# EAGLE design Linus.2 (EAGLE 9.2.2)
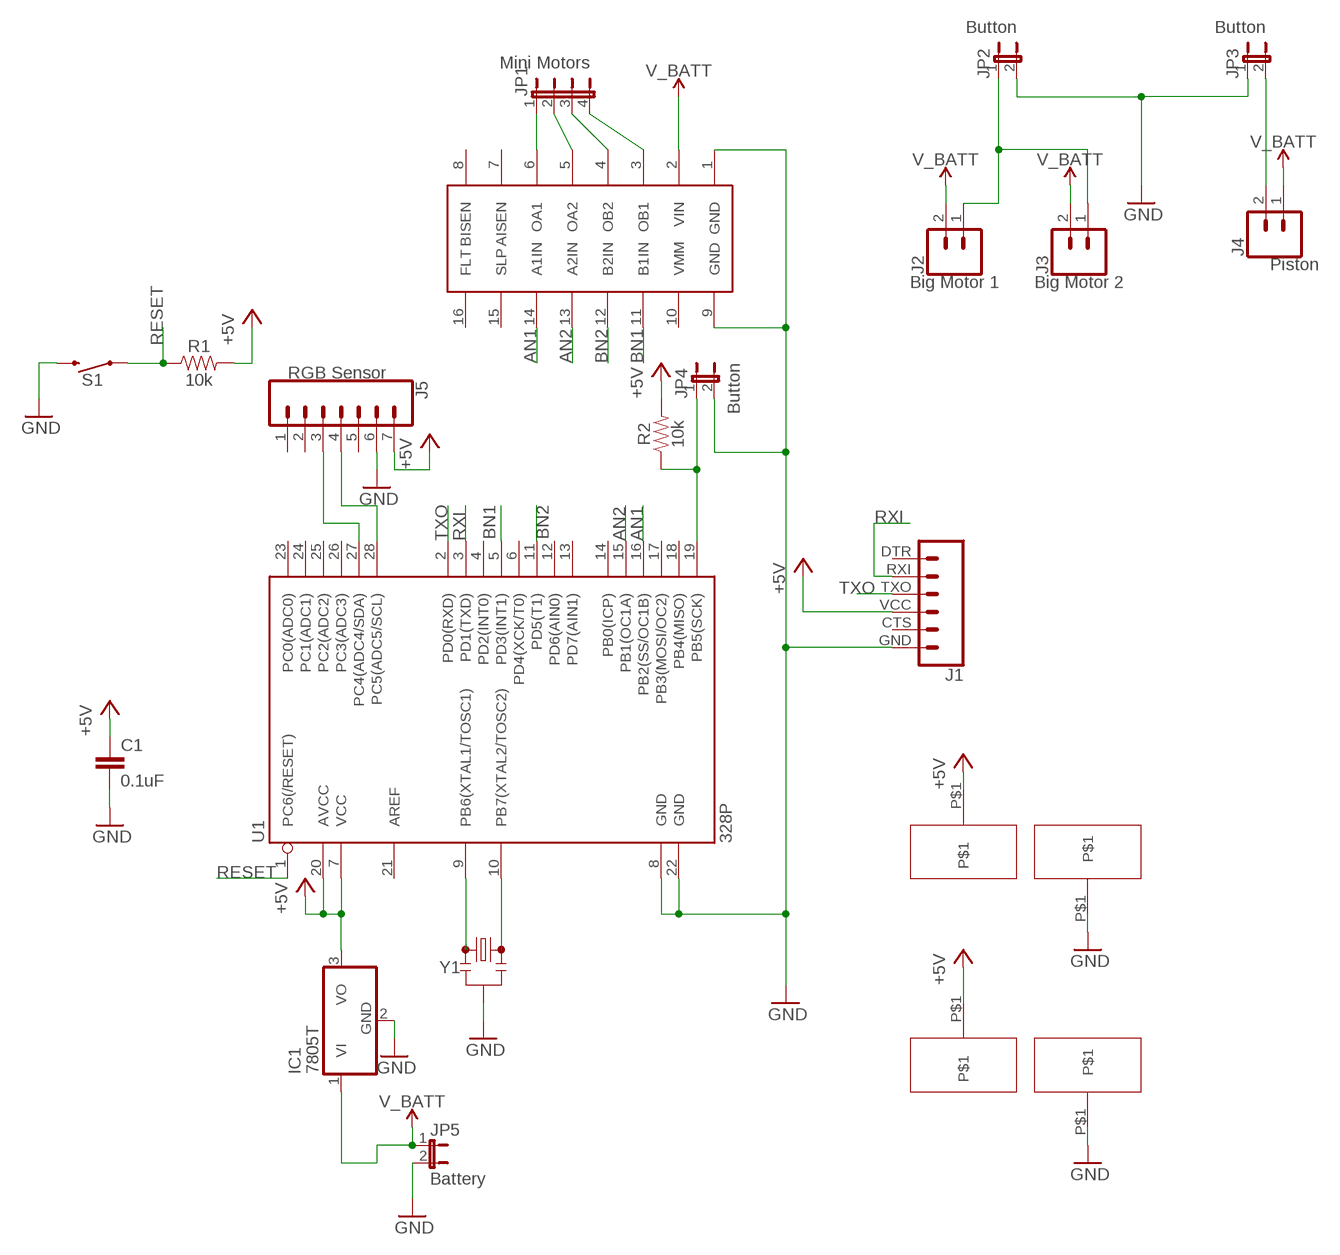
[diagram p0: schematic, sheet 1]

## Parts
C1  0.1uF  0.1UF-KIT-EZ-50V-20%  [CAP-PTH-SMALL-KIT]
IC1  7805T  [TO220H]
J1  6_PIN_SERIAL_CABLEPTH  [FTDI_BASIC]
J2  Big Motor 1  CONN_02  [1X02]
J3  Big Motor 2  CONN_02  [1X02]
J4  Piston  CONN_02  [1X02]
J5  RGB Sensor  CONN_07  [1X07]
JP1  Mini Motors  JP4E  [JP4]
JP2  Button  JP1E  [JP1]
JP3  Button  JP1E  [JP1]
JP4  Button  JP1E  [JP1]
JP5  Battery  JP1E  [JP1]
R1  10k  10KOHM-HORIZ-1/4W-1%  [AXIAL-0.3]
R2  10k  10KOHM-HORIZ-1/4W-1%  [AXIAL-0.3]
S1  MOMENTARY-SWITCH-SPST-PTH-6.0MM  [TACTILE_SWITCH_PTH_6.0MM]
U1  328P  ATMEGA328P_PDIP  [DIP28]
U$1  CONN_01  [CONN_01]  (not placed on a sheet)
U$2  MOTOR_DRIVER  [MOTOR_DRIVER]
U$3  CONN_01  [CONN_01]
U$4  CONN_01  [CONN_01]
U$5  CONN_01  [CONN_01]
U$6  CONN_01  [CONN_01]
Y1  RESONATORPTH-7.6X3.8  [RESONATOR-PTH-7.6X3.8]

## Nets
+5V: C1.1 IC1.3(VO) J1.VCC J5.7 R1.P$2 R2.P$2 U1.7(VCC) U1.20(AVCC) U$3.P$1 U$5.P$1
AN1: U1.16(PB2(SS/OC1B)) U$2.14(A1IN)
AN2: U1.15(PB1(OC1A)) U$2.13(A2IN)
BN1: U1.5(PD3(INT1)) U$2.11(B1IN)
BN2: U1.11(PD5(T1)) U$2.12(B2IN)
GND: C1.2 IC1.2(GND) J5.6 JP2.2 JP3.1 JP5.2 S1.3 U$4.P$1 U$6.P$1 Y1.2
N$1: J5.3 U1.27(PC4(ADC4/SDA))
N$2: J5.4 U1.28(PC5(ADC5/SCL))
N$3: U1.9(PB6(XTAL1/TOSC1)) Y1.1
N$4: U1.10(PB7(XTAL2/TOSC2)) Y1.3
N$5: JP1.1 U$2.6(OA1)
N$6: JP1.2 U$2.5(OA2)
N$7: JP1.3 U$2.4(OB2)
N$8: JP1.4 U$2.3(OB1)
N$10: J1.GND JP4.2 U1.8(GND) U1.22(GND) U$2.1(GND) U$2.9(GND) ; supply symbol labelled GND
N$12: J2.1 J3.1 JP2.1
N$13: J4.2 JP3.2
N$16: JP4.1 R2.P$1 U1.19(PB5(SCK))
RESET: R1.P$1 S1.1 U1.1(PC6(/RESET))
RXI: J1.RXI U1.3(PD1(TXD))
TXO: J1.TXO U1.2(PD0(RXD))
V_BATT: IC1.1(VI) J2.2 J3.2 J4.1 JP5.1 U$2.2(VIN)
Unconnected: J1.CTS J1.DTR J5.1 J5.2 J5.5 U1.4(PD2(INT0)) U1.6(PD4(XCK/T0)) U1.12(PD6(AIN0)) U1.13(PD7(AIN1)) U1.14(PB0(ICP)) U1.17(PB3(MOSI/OC2)) U1.18(PB4(MISO)) U1.21(AREF) U1.23(PC0(ADC0)) U1.24(PC1(ADC1)) U1.25(PC2(ADC2)) U1.26(PC3(ADC3)) U$1.P$1 U$2.7(AISEN) U$2.8(BISEN) U$2.10(VMM) U$2.15(SLP) U$2.16(FLT)

## Library data of the parts
C1 = Linus Eagle Library:0.1UF: 0.1µF ceramic capacitors A capacitor is a passive two-terminal electrical component used to store electrical energy temporarily in an electric field.; PROD_ID: CAP-08370
IC1 = adafruit:78*: Positive VOLTAGE REGULATOR Added bigger pads to the TO-92 package
J1 = Linus Eagle Library:6_PIN_SERIAL_CABLE: 6-pin header connection for use with the "FTDI BASIC" pinout - CABLE SIDE. Also known as "Arduino Serial Program Header". This is used on a design to provide a 6-pin connection point for serial communication usually from a USB cable (D+/D-) to these headers (RX/TX). It also has the remaining pins necessary for programming in the Arduino evironment (DTR, GND, and sometimes VCC). Note, this device has "CABLE" in the name. It is intended to be used on a design that usually lives on the end of your USB cable and prvides the converter chip (FTDI232 or FTDI231x) to commnicate serial RX/TX. The "sister" device, named "TARGET" is inteneded to be used on a design that contains a target micro-controller that you wish to program. You can populate with some of these: Female Headers <https://www.sparkfun.com/products/115> (PRT-00115) For reference (or to suit your programming needs) check out these designs: SparkFun FTDI Basic Breakout - 5V <https://www.sparkfun.com/products/9716> (DEV-09716) SparkFun FTDI Basic Breakout - 3.3V <https://www.sparkfun.com/products/9873> (DEV-09873) SparkFun FTDI SmartBasic <https://www.sparkfun.com/products/12935> (DEV-12935) SparkFun Beefy 3 - FTDI Basic Breakout <https://www.sparkfun.com/products/13746> (DEV-13746)
J2-J4 = Linus Eagle Library:CONN_02: Multi connection point. Often used as Generic Header-pin footprint for 0.1 inch spaced/style header connections On any of the 0.1 inch spaced packages, you can populate with these: Break Away Headers - Straight <https://www.sparkfun.com/products/116> (PRT-00116) Break Away Male Headers - Right Angle <https://www.sparkfun.com/products/553> (PRT-00553) Female Headers <https://www.sparkfun.com/products/115> (PRT-00115) Break Away Headers - Machine Pin <https://www.sparkfun.com/products/117> (PRT-00117) Break Away Female Headers - Swiss Machine Pin <https://www.sparkfun.com/products/743> (PRT-00743) For SCREWTERMINALS and SPRING TERMINALS visit here: Screw Terimnals on SparkFun.com <https://www.sparkfun.com/search/results?term=Screw+Terminals> (5mm/3.5mm/2.54mm spacing) This device is also useful as a general connection point to wire up your design to another part of your project. Our various solder wires solder well into these plated through hole pads. Hook-Up Wire - Assortment (Stranded, 22 AWG) <https://www.sparkfun.com/products/11375> (PRT-11375) Hook-Up Wire - Assortment (Solid Core, 22 AWG) <https://www.sparkfun.com/products/11367> (PRT-11367) View the entire wire category on our website here <https://www.sparkfun.com/categories/141> Special notes: Molex polarized connector foot print use with: PRT-08233 with associated crimp pins and housings. 2.54_SCREWTERM for use with PRT-10571. 3.5mm Screw Terminal footprints for PRT-08084 5mm Screw Terminal footprints for use with PRT-08432
J5 = Linus Eagle Library:CONN_07: Multi connection point. Often used as Generic Header-pin footprint for 0.1 inch spaced/style header connections On any of the 0.1 inch spaced packages, you can populate with these: Break Away Headers - Straight <https://www.sparkfun.com/products/116> (PRT-00116) Break Away Male Headers - Right Angle <https://www.sparkfun.com/products/553> (PRT-00553) Female Headers <https://www.sparkfun.com/products/115> (PRT-00115) Break Away Headers - Machine Pin <https://www.sparkfun.com/products/117> (PRT-00117) Break Away Female Headers - Swiss Machine Pin <https://www.sparkfun.com/products/743> (PRT-00743) For SCREWTERMINALS and SPRING TERMINALS visit here: Screw Terimnals on SparkFun.com <https://www.sparkfun.com/search/results?term=Screw+Terminals> (5mm/3.5mm/2.54mm spacing) This device is also useful as a general connection point to wire up your design to another part of your project. Our various solder wires solder well into these plated through hole pads. Hook-Up Wire - Assortment (Stranded, 22 AWG) <https://www.sparkfun.com/products/11375> (PRT-11375) Hook-Up Wire - Assortment (Solid Core, 22 AWG) <https://www.sparkfun.com/products/11367> (PRT-11367) View the entire wire category on our website here <https://www.sparkfun.com/categories/141> Special notes: Molex polarized connector foot print use with SKU : PRT-08231 with associated crimp pins and housings. 1MM SMD Version SKU: PRT-10208 NOTES ON THE VARIANTS LOCK and LOCK_LONGPADS... This footprint was designed to help hold the alignment of a through-hole component (i.e. 6-pin header) while soldering it into place. You may notice that each hole has been shifted either up or down by 0.005 of an inch from it's more standard position (which is a perfectly straight line). This slight alteration caused the pins (the squares in the middle) to touch the edges of the holes. Because they are alternating, it causes a "brace" to hold the component in place. 0.005 has proven to be the perfect amount of "off-center" position when using our standard breakaway headers. Although looks a little odd when you look at the bare footprint, once you have a header in there, the alteration is very hard to notice. Also,if you push a header all the way into place, it is covered up entirely on the bottom side.
JP1 = Linus Eagle Library:JP4E: JUMPER
JP2-JP4 = Linus Eagle Library:JP1E: JUMPER
JP5 = jumper:JP1E: JUMPER
R1 R2 = Linus Eagle Library:10KOHM: 10kΩ resistor A resistor is a passive two-terminal electrical component that implements electrical resistance as a circuit element. Resistors act to reduce current flow, and, at the same time, act to lower voltage levels within circuits. - Wikipedia; PROD_ID: RES-12183
S1 = Linus Eagle Library:MOMENTARY-SWITCH-SPST: Momentary Switch (Pushbutton) - SPST Normally-open (NO) SPST momentary switches (buttons, pushbuttons). Variants PTH-12MM - 12mm square, through-hole Momentary Pushbutton Switch - 12mm Square <https://www.sparkfun.com/products/9190> (COM-09190) PTH-6.0MM, PTH-6.0MM-KIT - 6.0mm square, through-hole Mini Pushbutton Switch <https://www.sparkfun.com/products/97> (COM-00097) KIT package intended for soldering kit's - only one side of pads' copper is exposed. PTH-RIGHT-ANGLE-KIT - Right-angle, through-hole Right Angle Tactile Button <https://www.sparkfun.com/products/10791> - Used on SparkFun BigTime Watch Kit <https://www.sparkfun.com/products/11734> SMD-12MM - 12mm square, surface-mount Tactile Button - SMD (12mm) <https://www.sparkfun.com/products/12993> (COM-12993) Used on SparkFun PicoBoard <https://www.sparkfun.com/products/11888> SMD-4.5MM - 4.5mm Square Trackball Switch Used on SparkFun Blackberry Trackballer Breakout <https://www.sparkfun.com/products/13169> SMD-4.6MMX2.8MM - 4.60mm x 2.80mm, surface mount Used on SparkFun SAMD21 Mini Breakout <https://www.sparkfun.com/products/13664> SMD-5.2MM, SMD-5.2-REDUNDANT - 5.2mm square, surface-mount Mini Pushbutton Switch - SMD <https://www.sparkfun.com/products/8720> (COM-08720) Used on Arduino Pro Mini <https://www.sparkfun.com/products/11114> REDUNDANT package connects both switch circuits together SMD-6.0X3.5MM - 6.0 x 3.5mm, surface mount Momentary Reset Switch SMD <https://www.sparkfun.com/products/8229> (COM-08229) SMD-6.2MM-TALL - 6.2mm square, surface mount Tactile Button - SMD (6mm) <https://www.sparkfun.com/products/12992> Used on SparkFun Digital Sandbox <https://www.sparkfun.com/products/12651> SMD-RIGHT-ANGLE - Right-angle, surface mount Used on SparkFun Block for Intel® Edison - Arduino <https://www.sparkfun.com/products/13036>; PROD_ID: SWCH-08441; SF_SKU: COM-00097
U1 = Linus Eagle Library:ATMEGA328P_PDIP: Atmel 328P Through hole ATMEGA328P uC used in the Arduino 32kb flash, 1k EEPROM, 2k SRAM Datasheet <http://www.sparkfun.com/datasheets/Components/SMD/ATMega328.pdf> SparkFun Products Storefront component: AVR 28 Pin 20MHz 32K 6A/D - ATMega328P <https://www.sparkfun.com/products/9061> (COM-09061) SparkFun Simon Says - Through-Hole Soldering Kit <https://www.sparkfun.com/products/10547> (KIT-10547) SparkFun Learn to Solder - Simon Says <https://www.sparkfun.com/products/13708> (KIT-13708) SparkFun BigTime Watch Kit <https://www.sparkfun.com/products/11734> (KIT-11734) SparkFun ClockIt <https://www.sparkfun.com/products/10930> (KIT-10930) SparkFun Serial Enabled LCD Kit <https://www.sparkfun.com/products/10097> (LCD-10097) SparkFun Simon Tilts - Through Hole Soldering Kit <https://www.sparkfun.com/products/12634> (KIT-12634) SparkFun Frequency Counter Kit <https://www.sparkfun.com/products/10140> (KIT-10140) FabFM Radio Kit <https://www.sparkfun.com/products/11043> (KIT-11043) SparkFun Binary Blaster Kit <https://www.sparkfun.com/products/12037> (KIT-12037) SparkFun Metro-Gnome <https://www.sparkfun.com/products/9236> (KIT-09236) ATmega328 with Arduino Optiboot (Uno) <https://www.sparkfun.com/products/10524> (DEV-10524); PROD_ID: IC-09136
U$1 U$3-U$6 = Linus Eagle Library:CONN_01
U$2 = Linus Eagle Library:MOTOR_DRIVER
Y1 = Linus Eagle Library:RESONATOR: Resonators (Generic) Ceramic resonators are clock-generating components, often used to control timing in microcontrollers. They usually have 3 pins: two pins for oscillation, and one pin for ground. Compared to crystals, resonators have worse tolerance, but are usually much cheaper. Plus, they have built-in load capacitors! These devices are used on boards like the Arduino Pro 8MHz <https://www.sparkfun.com/products/11114> and Arduino Pro 16MHz <https://www.sparkfun.com/products/11113>.

## Net classes
0 default: width 0.457 mm

## Board
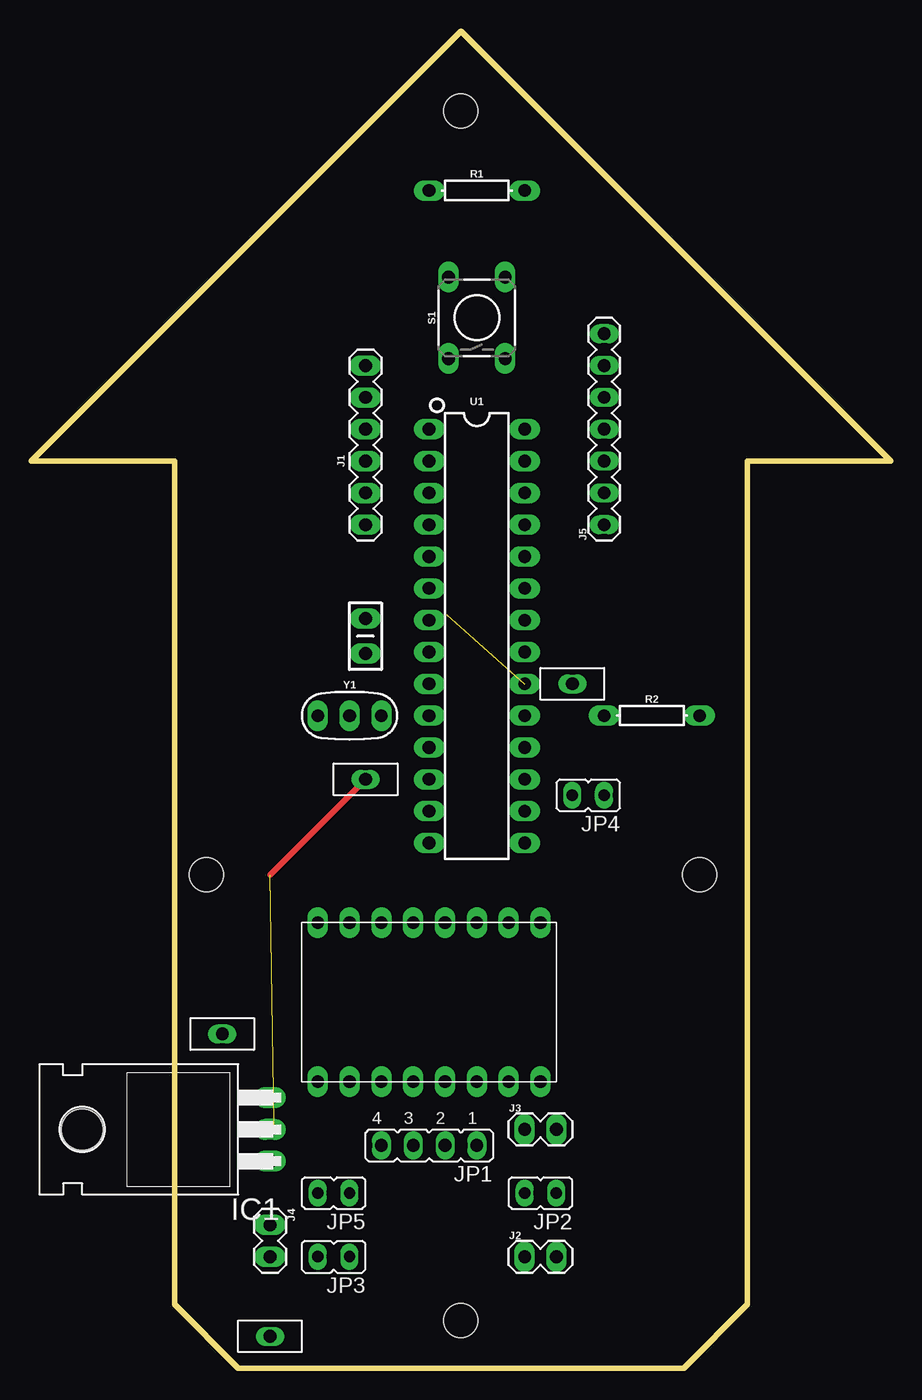
[diagram p1: board, top side]
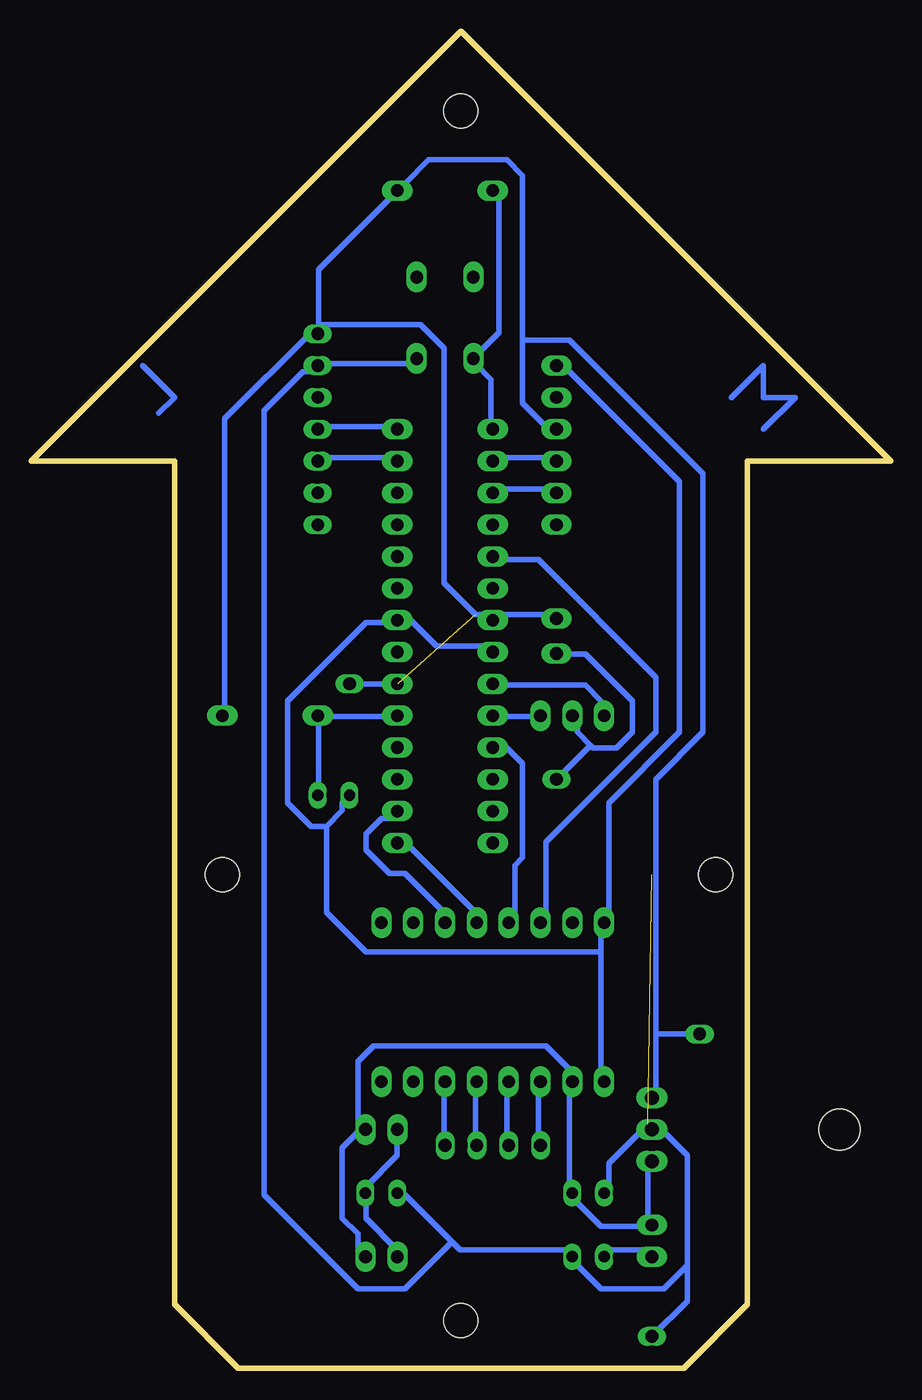
[diagram p2: board, bottom side, seen from below]

Size 68.58 x 106.68 mm. Coordinates in mm from the lower left corner, seen from the top.
Outline: 16.51,0 52.07,0 57.15,5.08 57.15,72.39 68.58,72.39 34.29,106.68 0,72.39 11.43,72.39 11.43,5.08 16.51,0
Copper layers (1*16): Top 0.035mm / dielectric 1.5mm / Bottom 0.035mm
Design rules "OthermillDRC_1_32_v2": minimum track width 8mil, minimum drill 0.8mm, track to track 0.794003125mm, track to pad 0.794003125mm, pad to pad 0.794003125mm, via to via 0.794003125mm, smd to smd 0mil, copper to edge 0mil, drill to drill 1mil, minimum pad ring 10mil, minimum via ring 10mil, stop-mask expansion 1mil, vias tented up to drill 30mil, thermal gap 10mil
Holes 2.73 mm at 34.29,100.33 34.29,3.81 13.97,39.37 53.34,39.37

### Footprints (pad centres in the part's own frame; a part is rotated, then mirrored left to right if it is on the bottom)
CAP-PTH-SMALL-KIT = drill 1.016 pad 1.651 long: 1 -1.397,0; 2 1.397,0
TO220H = drill 1.118 long: 1 -2.54,-10.16; 2 0,-10.16; 3 2.54,-10.16 | hole 3.302: 0,4.826
FTDI_BASIC = drill 1.016 pad 1.651 long: CTS 10.16,0; DTR 0,0; GND 12.7,0; RXI 2.54,0; TXO 5.08,0; VCC 7.62,0
1X02 = drill 1.016 pad 1.651 long: 1 0,0; 2 2.54,0
1X07 = drill 1.016 long: 1 0,0; 2 2.54,0; 3 5.08,0; 4 7.62,0; 5 10.16,0; 6 12.7,0; 7 15.24,0
JP4 = drill 1.016 long: 1 -3.81,0; 2 -1.27,0; 3 1.27,0; 4 3.81,0
JP1 = drill 0.914 long: 1 0,-1.27; 2 0,1.27
AXIAL-0.3 = drill 1.016 pad 1.651 long: P$1 -3.81,0; P$2 3.81,0
TACTILE_SWITCH_PTH_6.0MM = drill 1.016 pad 1.651 long: 1 -3.251,2.261; 2 3.251,2.261; 3 -3.251,-2.261; 4 3.251,-2.261
DIP28 = drill 1.016 pad 1.651 long: 1 -16.51,-3.81; 2 -13.97,-3.81; 3 -11.43,-3.81; 4 -8.89,-3.81; 5 -6.35,-3.81; 6 -3.81,-3.81; 7 -1.27,-3.81; 8 1.27,-3.81; 9 3.81,-3.81; 10 6.35,-3.81; 11 8.89,-3.81; 12 11.43,-3.81; 13 13.97,-3.81; 14 16.51,-3.81; 15 16.51,3.81; 16 13.97,3.81; 17 11.43,3.81; 18 8.89,3.81; 19 6.35,3.81; 20 3.81,3.81; 21 1.27,3.81; 22 -1.27,3.81; 23 -3.81,3.81; 24 -6.35,3.81; 25 -8.89,3.81; 26 -11.43,3.81; 27 -13.97,3.81; 28 -16.51,3.81
MOTOR_DRIVER = drill 1.016 pad 1.651 long: 1 -12.7,8.89; 2 -12.7,6.35; 3 -12.7,3.81; 4 -12.7,1.27; 5 -12.7,-1.27; 6 -12.7,-3.81; 7 -12.7,-6.35; 8 -12.7,-8.89; 9 0,8.89; 10 0,6.35; 11 0,3.81; 12 0,1.27; 13 0,-1.27; 14 0,-3.81; 15 0,-6.35; 16 0,-8.89
CONN_01 = drill 1.016 long: P$1 0,0
RESONATOR-PTH-7.6X3.8 = drill 1.016 pad 1.651 long: 1 -2.54,0; 2 0,0; 3 2.54,0

### Placement (x,y rotation side)
C1  26.67,58.42 270 top
IC1  8.89,19.05 90 top
J1  26.67,67.31 90 top
J2  39.37,8.89 0 top
J3  39.37,19.05 0 top
J4  19.05,11.43 270 top
J5  45.72,67.31 90 top
JP1  31.75,17.78 180 top
JP2  40.64,13.97 90 top
JP3  24.13,8.89 90 top
JP4  44.45,45.72 90 top
JP5  24.13,13.97 90 top
R1  35.56,93.98 0 top
R2  49.53,52.07 0 top
S1  35.56,83.82 90 top
U1  35.56,58.42 270 top
U$2  31.75,35.56 90 top
U$3  15.24,26.67 180 top
U$4  26.67,46.99 0 top
U$5  43.18,54.61 0 top
U$6  19.05,2.54 0 top
Y1  25.4,52.07 0 top

### Tracks (layer width: path | path; a pad name or v marks a point on that pad's centre or on a via)
+5V  (1 unrouted)
  Bottom 0.457: C1.1 26.87,60.13 31.25,60.13 U1.7 31.87,60.13 33.12,60.13 35.63,62.63 35.63,81.4 37.5,83.28 45.64,83.28 | 45.64,83.28 45.64,87.66 39.38,93.91 R1.P$2 38.75,94.54 36.88,96.42 30.62,96.42 29.37,95.17 29.37,82.03 | 45.64,83.28 45.64,82.65 J5.7 | 29.37,82.03 29.37,77.02 27.49,75.15 26.87,75.15 J1.VCC | R2.P$2 53.14,52.63 53.14,75.77 46.26,82.65 J5.7 | 18.74,26.67 18.74,46.99 14.98,50.75 14.98,71.39 25.62,82.03 29.37,82.03 | 18.74,26.67 18.74,21.97 IC1.3 | 45.64,83.28 J5.7 | U$3.P$1 18.74,26.67 | U$5.P$1 U1.20
AN1
  Bottom 0.457: U$2.14 35.63,35.73 35.63,36.36 38.75,39.49 40.01,39.49 41.88,41.36 41.88,42.62 40.63,43.87 39.38,43.87 U1.16
AN2
  Bottom 0.457: U$2.13 33.12,35.73 33.12,36.36 38.75,41.99 U1.15
BN1
  Bottom 0.457: U$2.11 27.49,35.73 27.49,41.99 18.74,50.75 18.74,55.13 28.12,64.51 31.25,64.51 U1.5
BN2
  Bottom 0.457: U$2.12 30,35.73 30,40.11 29.37,40.74 29.37,48.25 31.25,50.12 U1.11
GND  (1 unrouted)
  Top 0.457: 19.05,39.37 U$4.P$1
  Bottom 0.457: 23.95,49.71 23.74,49.5 21.86,49.5 20.61,50.75 20.61,53.25 24.37,57 26.24,57 C1.2 | 23.95,49.71 24.99,50.75 24.99,52 Y1.2 | JP5.2 22.49,14.46 22.49,16.34 19.36,19.47 IC1.2 18.74,18.84 18.11,18.84 16.23,16.97 16.23,8.89 16.23,8.21 | S1.3 38.13,80.15 45.64,80.15 J5.6 46.26,79.53 46.89,79.53 50.02,76.4 50.02,13.84 42.51,6.33 38.75,6.33 35,10.09 | 35,10.09 38.75,13.84 JP2.2 | 35,10.09 34.38,9.46 25.62,9.46 JP3.1 25.62,8.83 23.11,6.33 18.11,6.33 16.23,8.21 | 23.95,49.71 U$4.P$1 | 16.23,8.21 16.23,5.36 U$6.P$1
N$1
  Bottom 0.457: J5.3 45.64,72.64 39.38,72.64 U1.27
N$2
  Bottom 0.457: J5.4 45.64,75.15 39.38,75.15 U1.28
N$3
  Bottom 0.457: Y1.1 23.11,52.63 23.11,53.25 24.37,54.5 31.25,54.5 U1.9
N$4
  Bottom 0.457: Y1.3 28.12,52 31.25,52 U1.10
N$5
  Bottom 0.457: JP1.1 35.63,18.22 35.63,22.6 U$2.6
N$6
  Bottom 0.457: JP1.2 33.12,18.22 33.12,22.6 U$2.5
N$7
  Bottom 0.457: JP1.3 30.62,18.22 30.62,22.6 U$2.4
N$8
  Bottom 0.457: JP1.4 28.12,18.22 28.12,22.6 U$2.3
N$10
  Bottom 0.457: 45.01,43.24 43.76,44.49 43.76,45.12 JP4.2 | 45.01,43.24 46.26,43.24 48.14,45.12 48.14,53.25 41.88,59.51 39.38,59.51 U1.22 38.75,60.13 36.25,57.63 31.87,57.63 U1.8 | 23.11,33.23 23.11,35.11 U$2.9 22.49,35.73 22.49,45.12 16.86,50.75 16.86,70.77 25.62,79.53 26.24,79.53 J1.GND | 23.11,33.23 23.11,23.22 U$2.1 | 45.01,43.24 45.01,36.36 41.88,33.23 23.11,33.23
N$12
  Bottom 0.457: J2.1 39.38,9.46 41.88,11.96 41.88,13.84 JP2.1 41.88,14.46 39.38,16.97 39.38,18.84 J3.1
N$13
  Bottom 0.457: JP3.2 22.49,9.46 19.36,9.46 J4.2
N$16
  Bottom 0.457: 45.64,52 45.64,45.74 JP4.1 | 45.64,52 39.38,52 U1.19 | 45.64,52 R2.P$1
RESET
  Bottom 0.457: U1.1 31.87,75.15 31.87,78.9 33.12,80.15 S1.1 33.12,80.78 31.25,82.65 31.25,93.91 R1.P$1
RXI
  Bottom 0.457: J1.RXI 26.87,70.14 31.25,70.14 U1.3
S$1
  Bottom 0.457: 10.16,74.93 7.62,77.47 10.16,77.47 10.16,80.01 12.7,77.47
S$2
  Bottom 0.457: 59.69,80.01 57.15,77.47 58.42,76.2
TXO
  Bottom 0.457: J1.TXO 26.87,72.64 31.25,72.64 U1.2
V_BATT
  Bottom 0.457: J2.2 42.51,9.46 42.51,10.71 43.76,11.96 43.76,17.59 42.51,18.84 J3.2 42.51,19.47 42.51,24.47 41.26,25.73 27.49,25.73 24.99,23.22 U$2.2 25.62,22.6 25.62,14.46 JP5.1 25.62,13.84 23.11,11.34 19.36,11.34 J4.1 19.36,11.96 19.36,16.34 IC1.1